# EAGLE design transfer-block (EAGLE 7.6.0)
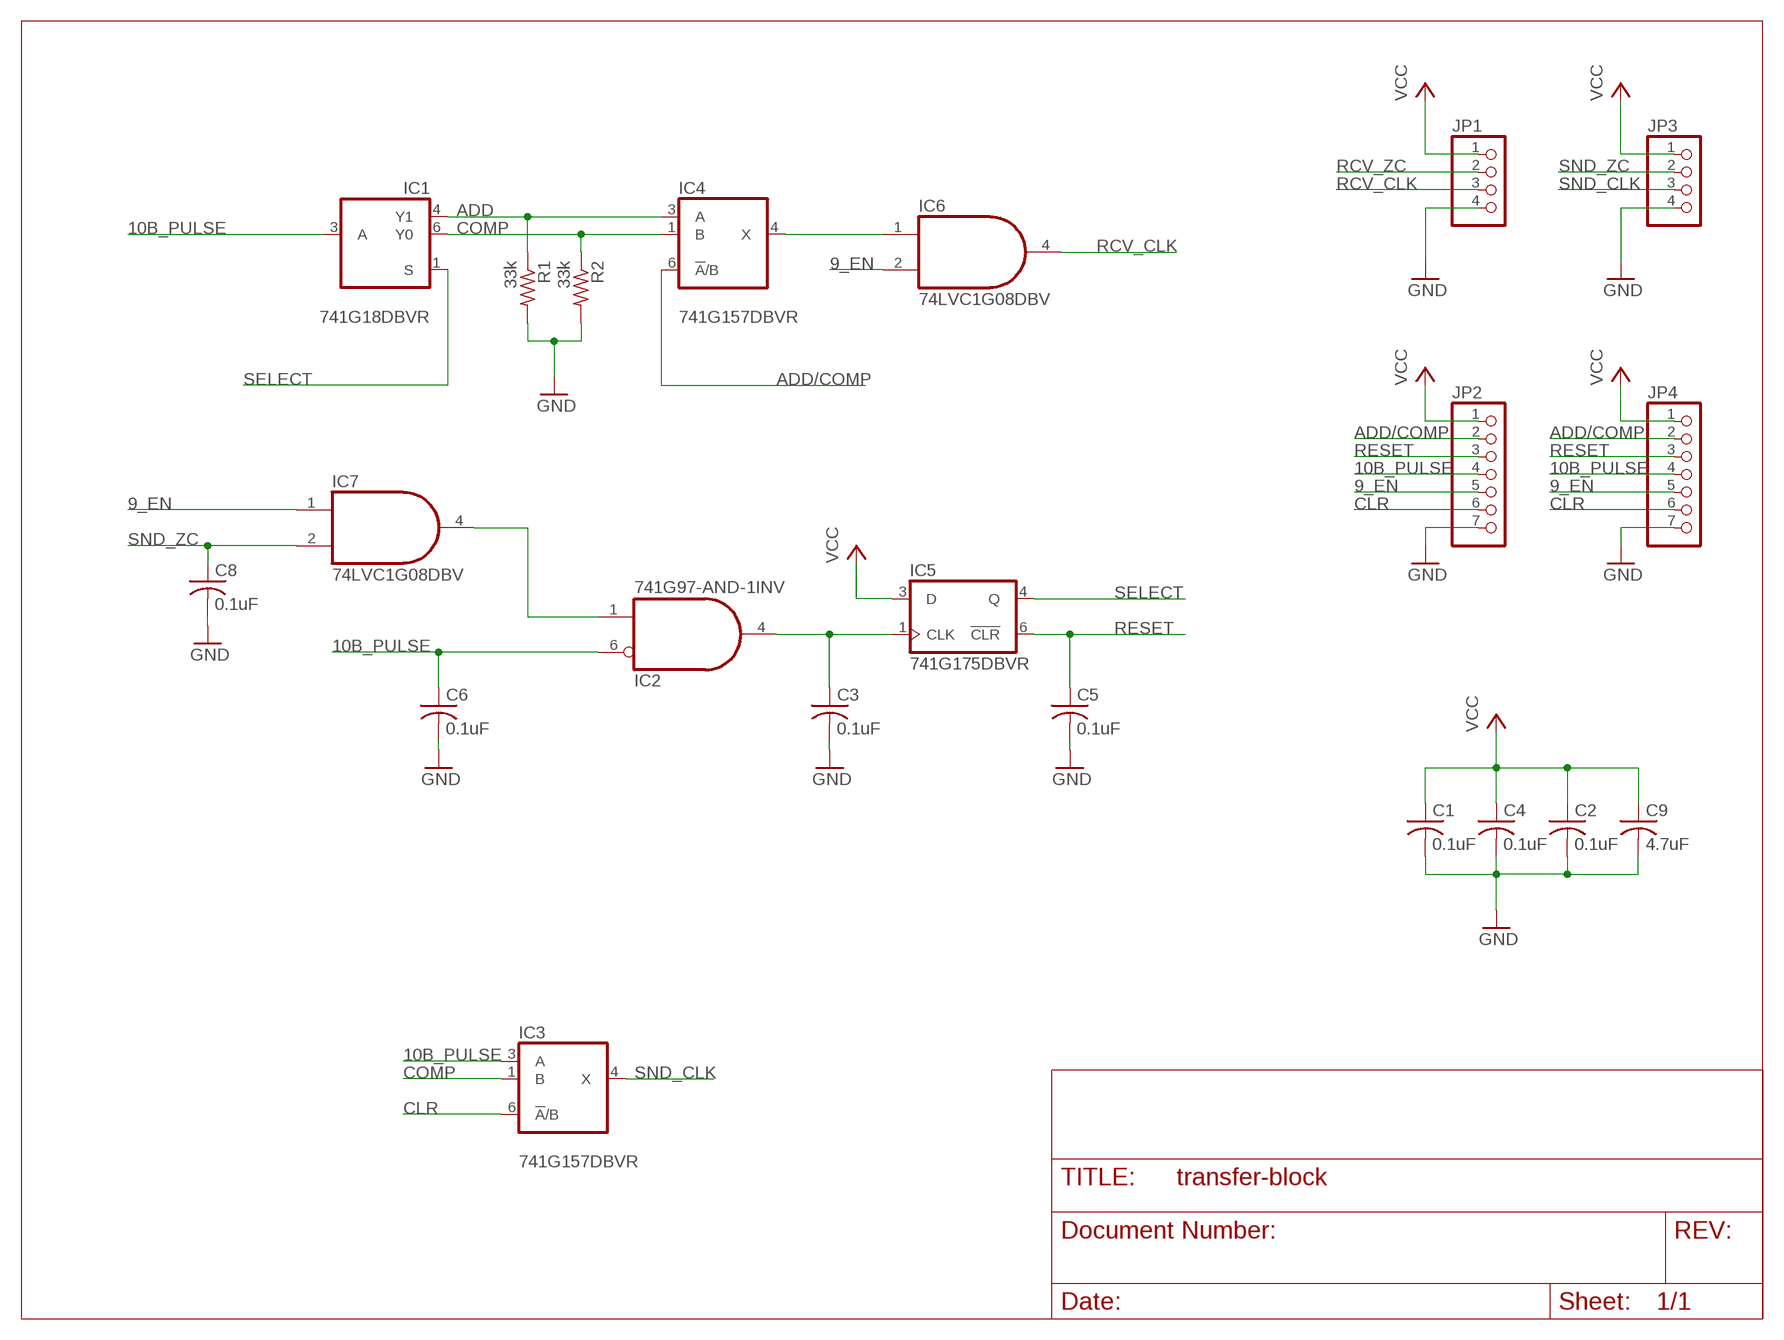
[diagram p0: schematic, sheet 1]

## Parts
C1  0.1uF  C-USC0603K  [C0603K]
C2  0.1uF  C-USC0603K  [C0603K]
C3  0.1uF  C-USC0603K  [C0603K]
C4  0.1uF  C-USC0603K  [C0603K]
C5  0.1uF  C-USC0603K  [C0603K]
C6  0.1uF  C-USC0603K  [C0603K]
C8  0.1uF  C-USC0603K  [C0603K]
C9  4.7uF  C-USC0603K  [C0603K]
IC1  741G18DBVR  741G18  [DBV_R-PDSO-G6]
IC2  741G97-AND-1INV  [DBV_R-PDSO-G6]
IC3  741G157DBVR  741G3157DBVR  [DBV_R-PDSO-G6]
IC4  741G157DBVR  741G3157DBVR  [DBV_R-PDSO-G6]
IC5  741G175DBVR  741G175  [DBV_R-PDSO-G6]
IC6  74LVC1G08DBV  [SOT23-5]
IC7  74LVC1G08DBV  [SOT23-5]
JP1  PINHD-1X4  [1X04]
JP2  PINHD-1X7  [1X07]
JP3  PINHD-1X4  [1X04]
JP4  PINHD-1X7  [1X07]
R1  33k  R-US_R0603  [R0603]
R2  33k  R-US_R0603  [R0603]

## Nets
9_EN: IC6.2(I1) IC7.1(I0) JP2.5 JP4.5
10B_PULSE: C6.1 IC1.3(A) IC2.6(I0) IC3.3(A) JP2.4 JP4.4
ADD: IC1.4(Y1) IC4.3(A) R1.1
ADD/COMP: IC4.6(!A!/B) JP2.2 JP4.2
CLR: IC3.6(!A!/B) JP2.6 JP4.6
COMP: IC1.6(Y0) IC3.1(B) IC4.1(B) R2.1
GND: C1.2 C2.2 C3.2 C4.2 C5.2 C6.2 C8.2 C9.2 JP1.4 JP2.7 JP3.4 JP4.7 R1.2 R2.2
N$1: IC2.1(I1) IC7.4(O)
PRE_RCV_CLK: IC4.4(X) IC6.1(I0)
RCV_CLK: IC6.4(O) JP1.3
RCV_ZC: JP1.2
RESET: C5.1 IC5.6(!CLR) JP2.3 JP4.3
SELECT: IC1.1(S) IC5.4(Q)
SND_CLK: IC3.4(X) JP3.3
SND_ZC: C8.1 IC7.2(I1) JP3.2
VCC: C1.1 C2.1 C4.1 C9.1 IC5.3(D) JP1.1 JP2.1 JP3.1 JP4.1
ZC_EN: C3.1 IC2.4(O) IC5.1(CLK)

## Power pins joined to a net without a drawn wire
GND: IC1.2(GND) IC2.2(GND) IC2.3(GND) IC3.2(GND) IC4.2(GND) IC5.2(GND) IC6.3(GND) IC7.3(GND)
VCC: IC1.5(VCC) IC2.5(VCC) IC3.5(VCC) IC4.5(VCC) IC5.5(VCC) IC6.5(VCC) IC7.5(VCC)

## Library data of the parts
C1-C6 C8 C9 = resistor:C-US: CAPACITOR, American symbol
IC1 = witch-e:74*1G18: 1-OF-2 NONINVERTING DEMULTIPLEXER WITH 3-STATE DESELECTED OUTPUT
IC2 = witch-e:74*1G97-AND-1INV
IC3 IC4 = 74xx-little-us:74*1G3157: Single-Pole, Double-Throw Analog Switch Source: http://focus.ti.com/lit/ds/symlink/sn74lvc1g3157.pdf
IC5 = witch-e:74*1G175
IC6 IC7 = 74xx-little-us:74*1G08: 2-input AND gate
JP1 JP3 = pinhead:PINHD-1X4: PIN HEADER
JP2 JP4 = pinhead:PINHD-1X7: PIN HEADER
R1 R2 = resistor:R-US_: RESISTOR, American symbol

## Board
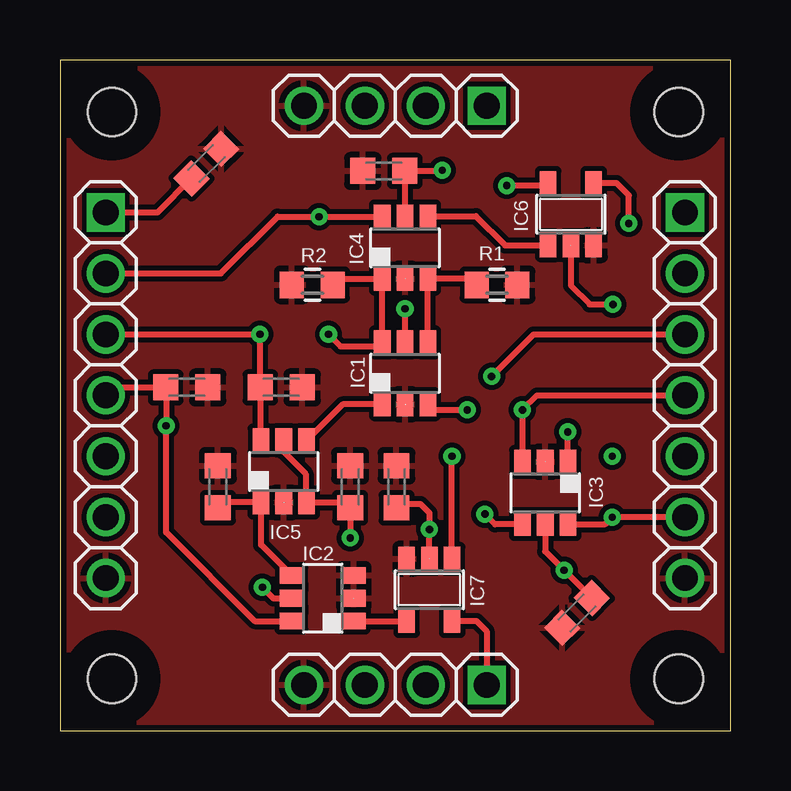
[diagram p1: board, top side]
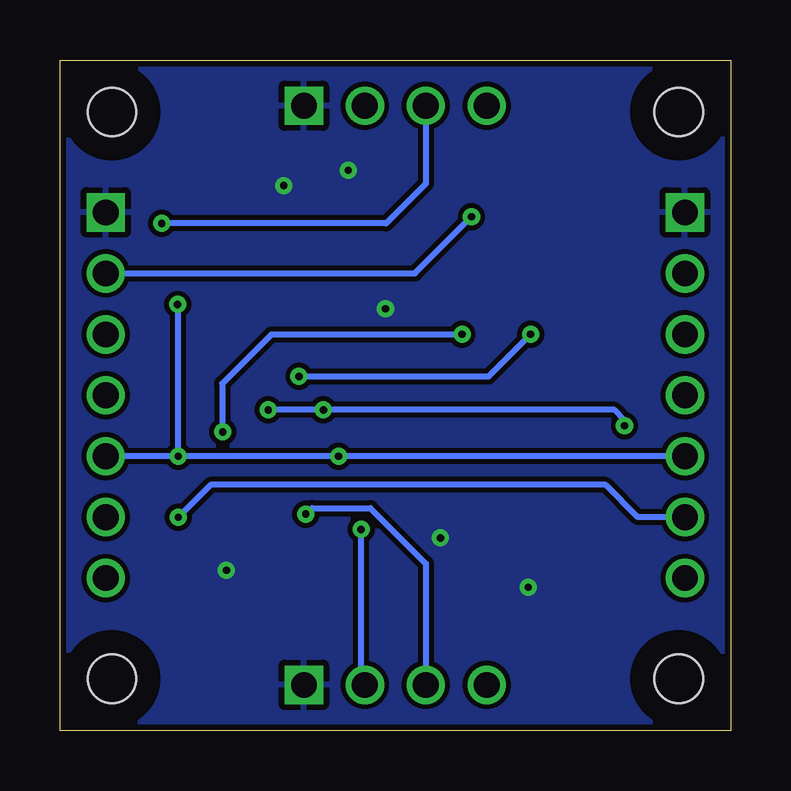
[diagram p2: board, bottom side, seen from below]

Size 27.94 x 27.94 mm. Coordinates in mm from the lower left corner, seen from the top.
Outline: 27.94,27.94 0,27.94 0,0 27.94,0 27.94,27.94
Copper layers (1*16): Top 0.035mm / dielectric 1.5mm / Bottom 0.035mm
Design rules "default *": minimum track width 8mil, minimum drill 12mil, track to track 8mil, track to pad 8mil, pad to pad 8mil, via to via 8mil, smd to smd 8mil, copper to edge 10mil, drill to drill 8mil, minimum pad ring 10mil, minimum via ring 8mil, stop-mask expansion 4mil, vias tented up to drill 0mil, thermal gap 10mil
Holes 2.01 mm at 2.16,2.16 25.78,2.16 25.78,25.78 2.16,25.78
tRestrict: area 23.8,0.2 to 27.8,4.2; area 23.8,23.8 to 27.8,27.8; area 0.2,23.8 to 4.2,27.8; area 0.2,0.2 to 4.2,4.2
bRestrict: area 23.8,0.2 to 27.8,4.2; area 23.8,23.8 to 27.8,27.8; area 0.2,23.8 to 4.2,27.8; area 0.2,0.2 to 4.2,4.2

### Footprints (pad centres in the part's own frame; a part is rotated, then mirrored left to right if it is on the bottom)
C0603K = smd 1.05 x 1.08: 1 -0.875,0; 2 0.875,0
DBV_R-PDSO-G6 = smd 0.69 x 0.99: 1 -0.95,-1.29; 2 0,-1.29; 3 0.95,-1.29; 4 0.95,1.3; 5 0,1.3; 6 -0.95,1.3
SOT23-5 = smd 0.69 x 0.99: 1 -0.95,-1.29; 2 0,-1.29; 3 0.95,-1.29; 4 0.95,1.3; 5 -0.95,1.3
1X04 = drill 1.067 square: 1 -3.81,0 | drill 1.067: 2 -1.27,0; 3 1.27,0; 4 3.81,0
1X07 = drill 1.067 square: 1 -7.62,0 | drill 1.067: 2 -5.08,0; 3 -2.54,0; 4 0,0; 5 2.54,0; 6 5.08,0; 7 7.62,0
R0603 = smd 1 x 1.1: 1 -0.85,0; 2 0.85,0

### Placement (x,y rotation side)
C1  6.1,23.62 45 top
C2  13.49,23.32 180 top
C3  6.58,10.16 90 top
C4  12.09,10.16 90 top
C5  9.22,14.3 0 top
C6  5.28,14.3 0 top
C8  14.02,10.16 90 top
C9  21.54,4.9 225 top
IC1  14.38,14.88 0 top
IC2  10.95,5.51 90 top
IC3  20.22,9.91 180 top
IC4  14.38,20.12 0 top
IC5  9.32,10.79 0 top
IC6  21.29,21.51 0 top
IC7  15.39,5.87 180 top
JP1  13.97,26.04 180 top
JP2  1.91,13.97 270 top
JP3  13.97,1.91 180 top
JP4  26.04,13.97 270 top
R1  18.21,18.57 0 top
R2  10.52,18.57 180 top

### Tracks (layer width: path | path; a pad name or v marks a point on that pad's centre or on a via)
9_EN  (via drill 0.3)
  Top 0.254: IC7.1 v16.33,11.43 | IC6.2 21.29,18.54 22.07,17.75 v23.04,17.75
  Bottom 0.254: v23.04,17.75 23.04,11.46 v23.01,11.43 | JP2.5 v16.33,11.43 v23.01,11.43 | v23.01,11.43 JP4.5
10B_PULSE  (via drill 0.3)
  Top 0.254: JP2.4 2.23,14.3 C6.1 4.42,14.29 v4.42,12.7 4.42,8.26 8.11,4.56 IC2.6 | IC1.3 15.32,13.58 15.54,13.36 v16.97,13.36 | JP4.4 19.88,13.97 v19.27,13.36 IC3.3
  Bottom 0.254: v4.42,12.7 4.42,12.95 4.83,13.36 v16.97,13.36 v19.27,13.36
ADD
  Top 0.254: IC1.4 IC4.3 17.1,18.83 R1.1
ADD/COMP  (via drill 0.3)
  Top 0.254: JP2.2 6.71,19.05 9.07,21.41 v10.79,21.41 IC4.6
  Bottom 0.254: JP4.2 13.16,19.05 v10.79,21.41
CLR  (via drill 0.3)
  Top 0.254: 21.18,8.59 IC3.6 22.73,8.61 v23.01,8.89 JP4.6
  Bottom 0.254: JP2.6 3.86,8.89 5.21,10.24 21.67,10.24 v23.01,8.89
COMP  (via drill 0.3)
  Top 0.254: IC3.1 arc-90 21.16,11.64 v21.16,12.45 | v11.19,16.51 11.7,16 13.24,16 IC1.6 IC4.1 11.62,18.83 R2.1
  Bottom 0.254: v21.16,12.45 21.18,12.6 21.18,14.45 19.13,16.51 v11.19,16.51
GND
  pour Top: 27.69,0.25 0.25,0.25 0.25,27.69 27.69,27.69
N$1
  Top 0.254: IC2.1 IC7.4
PRE_RCV_CLK
  Top 0.254: IC4.4 15.34,21.43 17.33,21.43 18.54,20.22 IC6.1
RCV_CLK  (via drill 0.3)
  Top 0.254: v23.7,21.13 23.7,22.3 23.19,22.81 IC6.4
  Bottom 0.254: JP1.3 12.7,22.78 14.35,21.13 v23.7,21.13
RESET  (via drill 0.3)
  Top 0.254: 8.33,12.14 IC5.6 8.35,12.12 C5.1 8.35,16.5 v8.33,16.51 JP2.3 | v17.98,14.76 19.74,16.51 JP4.3
  Bottom 0.254: v17.98,14.76 10.08,14.76 v8.33,16.51
SELECT
  Top 0.254: IC1.1 11.77,13.59 IC5.4
SND_CLK  (via drill 0.3)
  Top 0.254: IC3.4 19.25,8.59 18.13,8.59 v17.7,9.02
  Bottom 0.254: v17.7,9.02 17.45,9.27 15.01,9.27 12.7,6.96 JP3.3
SND_ZC  (via drill 0.3)
  Top 0.254: IC7.2 v15.39,8.38 15.39,9.07 15.01,9.45 14.31,9.45 C8.1
  Bottom 0.254: JP3.2 15.39,2.06 v15.39,8.38
VCC  (via drill 0.3)
  Top 0.254: IC5.5 9.32,11.61 10.24,10.69 10.24,9.54 IC5.3 12.08,9.51 C4.1 v12.09,8.03 | IC4.5 14.36,21.43 C2.1 15.9,23.32 v15.93,23.34 | IC3.5 20.22,7.47 v21.01,6.68 C9.1 | v8.43,5.97 8.89,5.51 IC2.5 | IC1.5 v14.38,17.58 | IC6.5 20.23,22.71 v18.62,22.71 | IC7.5 17.35,4.57 17.78,4.14 JP3.1 | JP2.1 4.06,21.59 C1.1
  pour Bottom: 27.69,0.25 0.25,0.25 0.25,27.69 27.69,27.69
ZC_EN
  Top 0.254: C3.1 6.59,9.51 IC5.1 8.37,7.73 8.38,7.73 IC2.4

### Text on the board
Document: XFER / UNIT